# Altium schematic sheet 0209_TBT_0_PWR.SchDoc
size A3
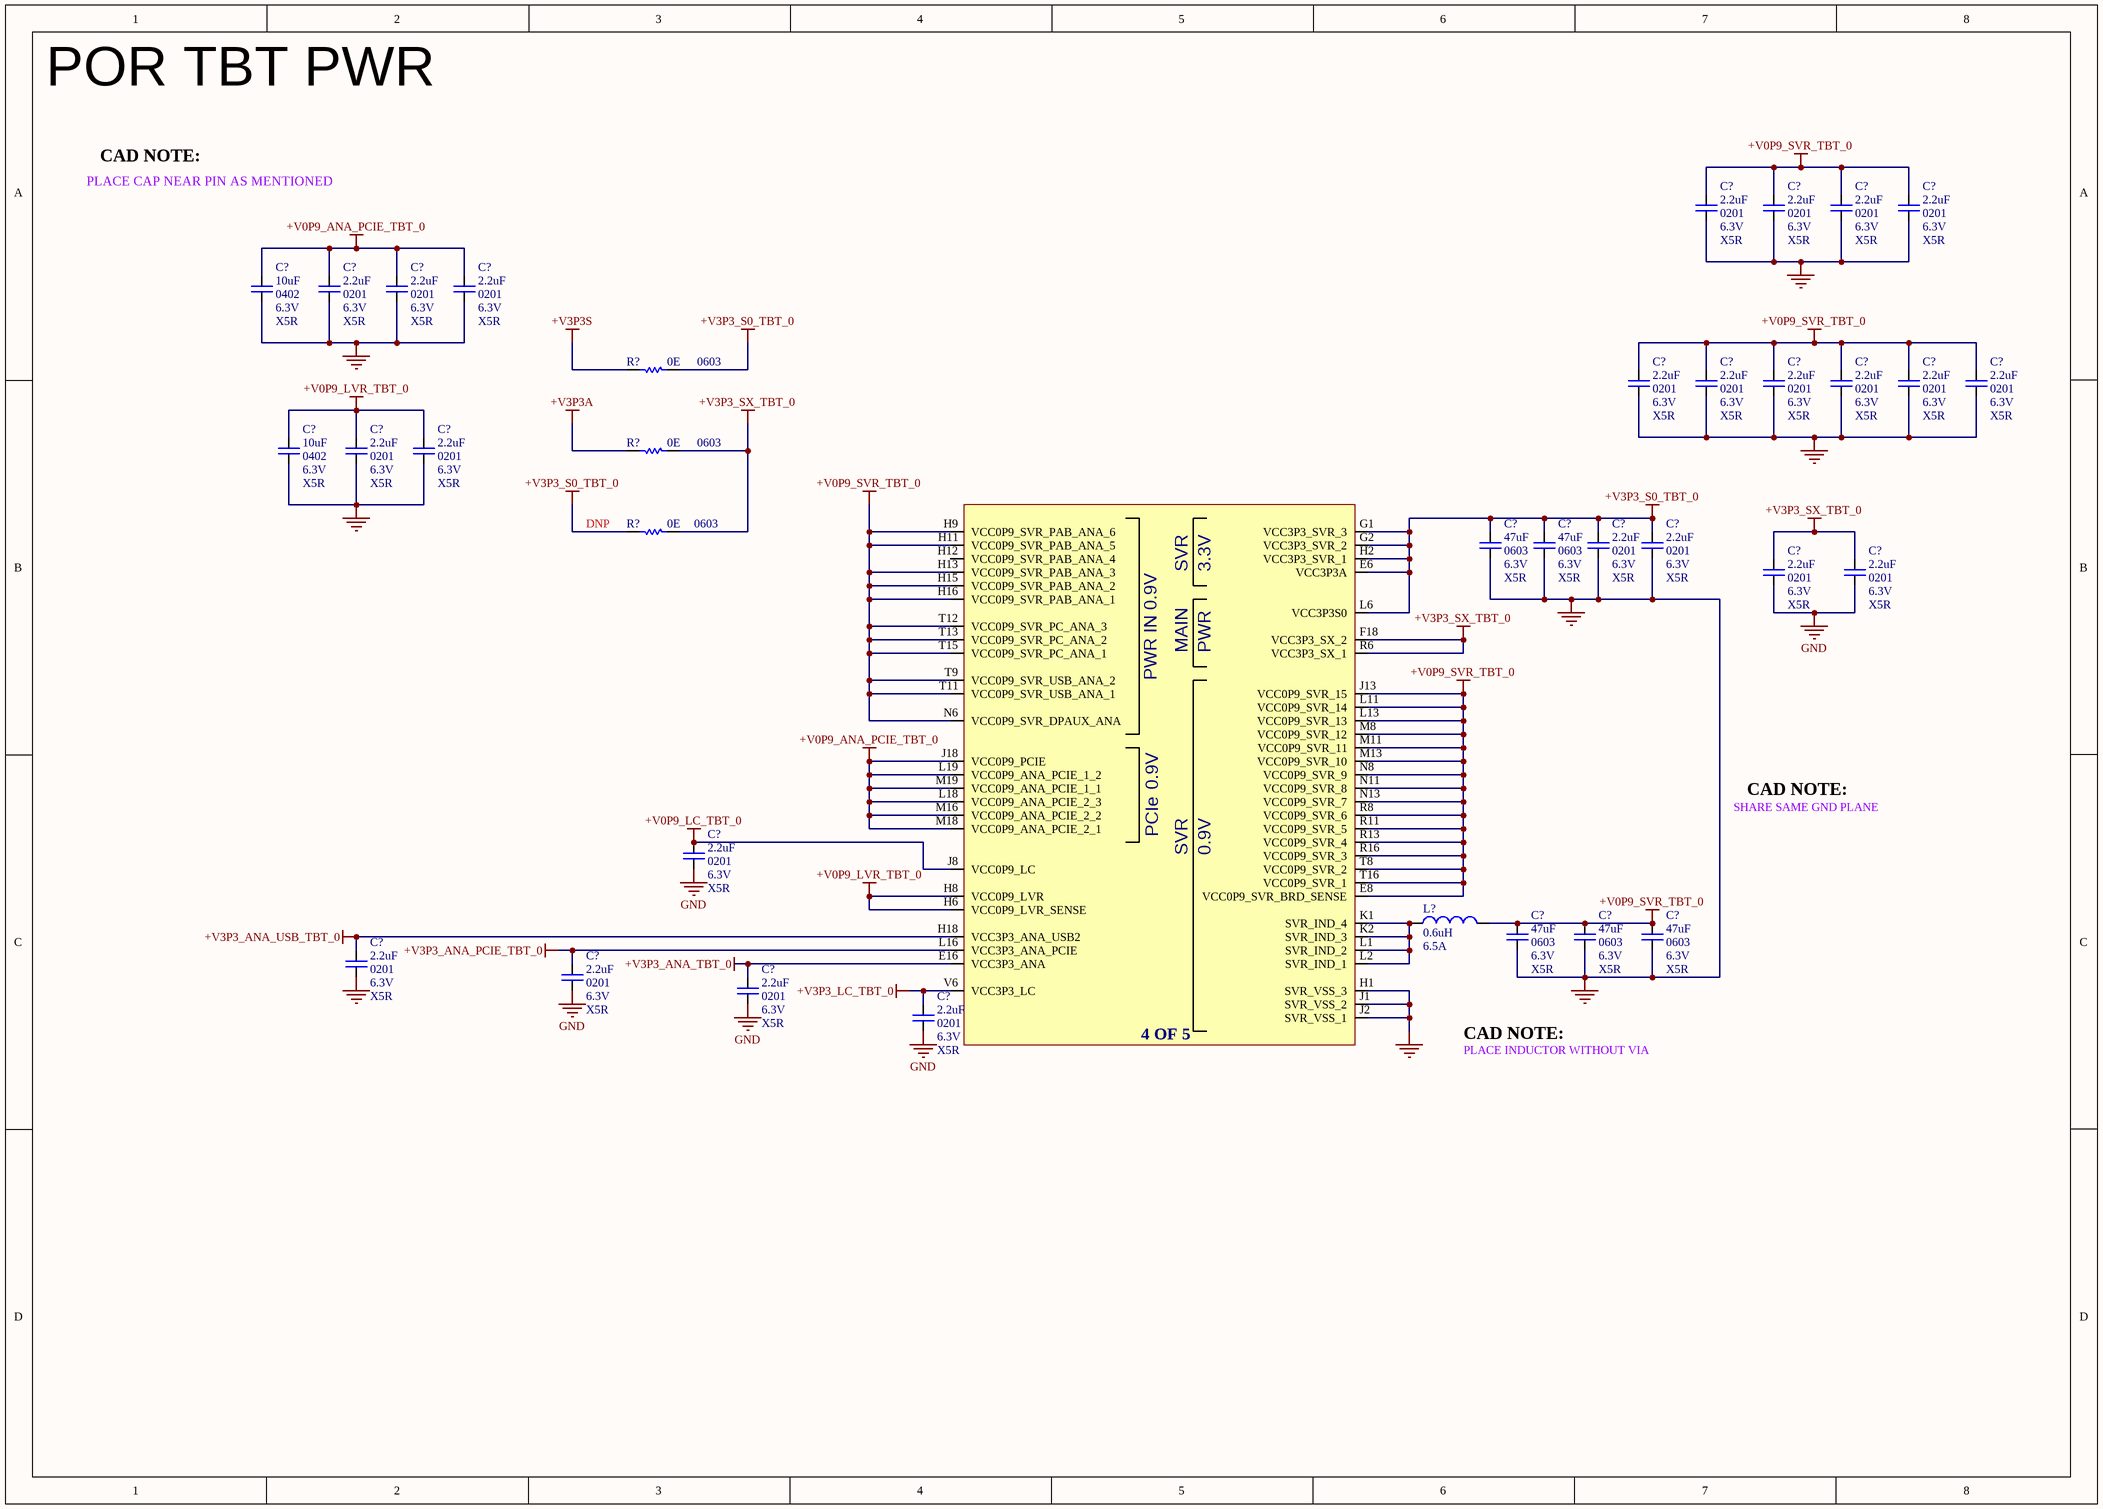
[diagram p0: 0209_TBT_0_PWR.SchDoc]

## Parts
(Parts that share a designator on the sheet are numbered #1, #2 ... from top to bottom, then left to right.)
C?#1  value 2.2uF  Case/Package: 0201  Voltage: 6.3V  Dielectric: X5R  [CAPC0201]
C?#2  value 2.2uF  Case/Package: 0201  Voltage: 6.3V  Dielectric: X5R  [CAPC0201]
C?#3  value 2.2uF  Case/Package: 0201  Voltage: 6.3V  Dielectric: X5R  [CAPC0201]
C?#4  value 2.2uF  Case/Package: 0201  Voltage: 6.3V  Dielectric: X5R  [CAPC0201]
C?#5  value 10uF  Case/Package: 0402  Voltage: 6.3V  Dielectric: X5R  [CAPC0402]
C?#6  value 2.2uF  Case/Package: 0201  Voltage: 6.3V  Dielectric: X5R  [CAPC0201]
C?#7  value 2.2uF  Case/Package: 0201  Voltage: 6.3V  Dielectric: X5R  [CAPC0201]
C?#8  value 2.2uF  Case/Package: 0201  Voltage: 6.3V  Dielectric: X5R  [CAPC0201]
C?#9  value 2.2uF  Case/Package: 0201  Voltage: 6.3V  Dielectric: X5R  [CAPC0201]
C?#10  value 2.2uF  Case/Package: 0201  Voltage: 6.3V  Dielectric: X5R  [CAPC0201]
C?#11  value 2.2uF  Case/Package: 0201  Voltage: 6.3V  Dielectric: X5R  [CAPC0201]
C?#12  value 2.2uF  Case/Package: 0201  Voltage: 6.3V  Dielectric: X5R  [CAPC0201]
C?#13  value 2.2uF  Case/Package: 0201  Voltage: 6.3V  Dielectric: X5R  [CAPC0201]
C?#14  value 2.2uF  Case/Package: 0201  Voltage: 6.3V  Dielectric: X5R  [CAPC0201]
C?#15  value 10uF  Case/Package: 0402  Voltage: 6.3V  Dielectric: X5R  [CAPC0402]
C?#16  value 2.2uF  Case/Package: 0201  Voltage: 6.3V  Dielectric: X5R  [CAPC0201]
C?#17  value 2.2uF  Case/Package: 0201  Voltage: 6.3V  Dielectric: X5R  [CAPC0201]
C?#18  value 47uF  Case/Package: 0603  Voltage: 6.3V  Dielectric: X5R  [CAPC0603]
C?#19  value 47uF  Case/Package: 0603  Voltage: 6.3V  Dielectric: X5R  [CAPC0603]
C?#20  value 2.2uF  Case/Package: 0201  Voltage: 6.3V  Dielectric: X5R  [CAPC0201]
C?#21  value 2.2uF  Case/Package: 0201  Voltage: 6.3V  Dielectric: X5R  [CAPC0201]
C?#22  value 2.2uF  Case/Package: 0201  Voltage: 6.3V  Dielectric: X5R  [CAPC0201]
C?#23  value 2.2uF  Case/Package: 0201  Voltage: 6.3V  Dielectric: X5R  [CAPC0201]
C?#24  value 2.2uF  Case/Package: 0201  Voltage: 6.3V  Dielectric: X5R  [CAPC0201]
C?#25  value 47uF  Case/Package: 0603  Voltage: 6.3V  Dielectric: X5R  [CAPC0603]
C?#26  value 47uF  Case/Package: 0603  Voltage: 6.3V  Dielectric: X5R  [CAPC0603]
C?#27  value 47uF  Case/Package: 0603  Voltage: 6.3V  Dielectric: X5R  [CAPC0603]
C?#28  value 2.2uF  Case/Package: 0201  Voltage: 6.3V  Dielectric: X5R  [CAPC0201]
C?#29  value 2.2uF  Case/Package: 0201  Voltage: 6.3V  Dielectric: X5R  [CAPC0201]
C?#30  value 2.2uF  Case/Package: 0201  Voltage: 6.3V  Dielectric: X5R  [CAPC0201]
C?#31  value 2.2uF  Case/Package: 0201  Voltage: 6.3V  Dielectric: X5R  [CAPC0201]
L?  value 0.6uH  Current: 6.5A  (hidden comment: Inductor)
R?#1  value 0E  Case/Package: 0603  [RESC0603]  (hidden comment: Res)
R?#2  value 0E  Case/Package: 0603  [RESC0603]  (hidden comment: Res)
R?#3  value 0E  Case/Package: 0603  [RESC0603]  (hidden comment: Res)
U5A2  C_MAPLE_RIDGE_DP  (value not drawn)  (part D of 5)

## Nets
+V0P9_ANA_PCIE_TBT_0: C?#5.2 C?#6.2 C?#7.2 C?#8.2 U5A2.J18(VCC0P9_PCIE) U5A2.L18(VCC0P9_ANA_PCIE_2_3) U5A2.L19(VCC0P9_ANA_PCIE_1_2) U5A2.M16(VCC0P9_ANA_PCIE_2_2) U5A2.M18(VCC0P9_ANA_PCIE_2_1) U5A2.M19(VCC0P9_ANA_PCIE_1_1)
+V0P9_LC_TBT_0: C?#24.2 U5A2.J8(VCC0P9_LC)
+V0P9_LVR_TBT_0: C?#15.2 C?#16.2 C?#17.2 U5A2.H6(VCC0P9_LVR_SENSE) U5A2.H8(VCC0P9_LVR)
+V0P9_SVR_TBT_0: C?#1.2 C?#2.2 C?#3.2 C?#4.2 C?#9.2 C?#10.2 C?#11.2 C?#12.2 C?#13.2 C?#14.2 C?#25.1 C?#26.1 C?#27.1 L?.2 U5A2.E8(VCC0P9_SVR_BRD_SENSE) U5A2.H9(VCC0P9_SVR_PAB_ANA_6) U5A2.H11(VCC0P9_SVR_PAB_ANA_5) U5A2.H13(VCC0P9_SVR_PAB_ANA_3) U5A2.H15(VCC0P9_SVR_PAB_ANA_2) U5A2.H16(VCC0P9_SVR_PAB_ANA_1) U5A2.J13(VCC0P9_SVR_15) U5A2.L11(VCC0P9_SVR_14) U5A2.L13(VCC0P9_SVR_13) U5A2.M8(VCC0P9_SVR_12) U5A2.M11(VCC0P9_SVR_11) U5A2.M13(VCC0P9_SVR_10) U5A2.N6(VCC0P9_SVR_DPAUX_ANA) U5A2.N8(VCC0P9_SVR_9) U5A2.N11(VCC0P9_SVR_8) U5A2.N13(VCC0P9_SVR_7) U5A2.R8(VCC0P9_SVR_6) U5A2.R11(VCC0P9_SVR_5) U5A2.R13(VCC0P9_SVR_4) U5A2.R16(VCC0P9_SVR_3) U5A2.T8(VCC0P9_SVR_2) U5A2.T9(VCC0P9_SVR_USB_ANA_2) U5A2.T11(VCC0P9_SVR_USB_ANA_1) U5A2.T12(VCC0P9_SVR_PC_ANA_3) U5A2.T13(VCC0P9_SVR_PC_ANA_2) U5A2.T15(VCC0P9_SVR_PC_ANA_1) U5A2.T16(VCC0P9_SVR_1)
+V3P3_ANA_PCIE_TBT_0: C?#29.2 U5A2.L16(VCC3P3_ANA_PCIE)
+V3P3_ANA_TBT_0: C?#30.2 U5A2.E16(VCC3P3_ANA)
+V3P3_ANA_USB_TBT_0: C?#28.2 U5A2.H18(VCC3P3_ANA_USB2)
+V3P3_LC_TBT_0: C?#31.2 U5A2.V6(VCC3P3_LC)
+V3P3_S0_TBT_0: C?#18.1 C?#19.1 C?#20.2 C?#21.2 R?#1.2 R?#3.1 U5A2.E6(VCC3P3A) U5A2.G1(VCC3P3_SVR_3) U5A2.G2(VCC3P3_SVR_2) U5A2.H2(VCC3P3_SVR_1) U5A2.L6(VCC3P3S0)
+V3P3_SX_TBT_0: C?#22.2 C?#23.2 R?#2.2 R?#3.2 U5A2.F18(VCC3P3_SX_2) U5A2.R6(VCC3P3_SX_1)
+V3P3A: R?#2.1
+V3P3S: R?#1.1
GND: C?#1.1 C?#2.1 C?#3.1 C?#4.1 C?#5.1 C?#6.1 C?#7.1 C?#8.1 C?#9.1 C?#10.1 C?#11.1 C?#12.1 C?#13.1 C?#14.1 C?#15.1 C?#16.1 C?#17.1 C?#18.2 C?#19.2 C?#20.1 C?#21.1 C?#22.1 C?#23.1 C?#24.1 C?#25.2 C?#26.2 C?#27.2 C?#28.1 C?#29.1 C?#30.1 C?#31.1 U5A2.H1(SVR_VSS_3) U5A2.J1(SVR_VSS_2) U5A2.J2(SVR_VSS_1)
NetL?_1: L?.1 U5A2.K1(SVR_IND_4) U5A2.K2(SVR_IND_3) U5A2.L1(SVR_IND_2) U5A2.L2(SVR_IND_1)

Not connected (* = marked no-connect by the designer): U5A2 H12(VCC0P9_SVR_PAB_ANA_4)

## Notes on the sheet
- POR TBT PWR
- CAD NOTE:
- PLACE CAP NEAR PIN AS MENTIONED
- SHARE SAME GND PLANE
- PLACE INDUCTOR WITHOUT VIA
- (in symbol C_MAPLE_RIDGE_DP, part D) 3.3V; SVR; PWR IN 0.9V; PWR; MAIN; 0.9V; PCIe; 4 OF 5

## Library data of the parts
C?#1-C?#4 C?#6-C?#14 C?#16 C?#17 C?#20-C?#24 C?#28-C?#31 = Cap: CAP CER 2.2uF 6.3V X5R 0201
C?#5 C?#15 = Cap: CAP CER 10uF 6.3V X5R 0402
C?#18 C?#19 C?#25-C?#27 = Cap: CAP CER 47uF 6.3V X5R 0603
R?#1-R?#3 = Res: Thick Film Resistor - 0ohm, 1%, 0603
  R?#3: DNP: DNP
L? = Inductor: Manufacturer Part Number: *; Case/Package: *
U5A2 = C_MAPLE_RIDGE_DP: Case/Package: *; Manufacturer Part Number: *